# EAGLE design RFM2Pi_v2.5 (EAGLE 6.1)
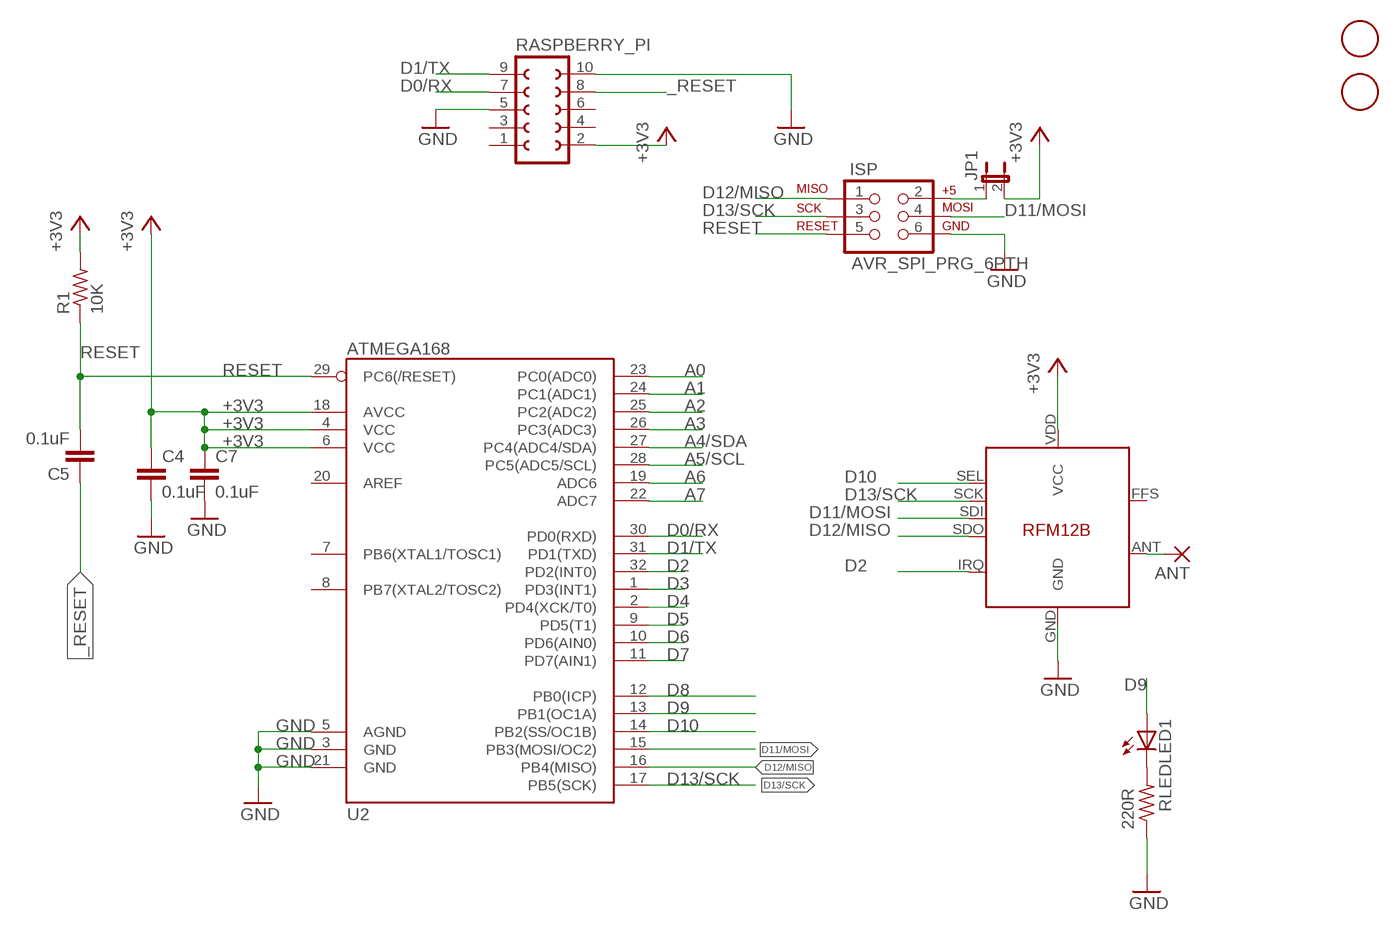
[diagram p0: schematic, sheet 1]

## Parts
ANT  1,6/0,8  [1,6/0,8]
C4  0.1uF  C-EUC0603  [C0603]
C5  0.1uF  C-EUC0603  [C0603]
C7  0.1uF  C-EUC0603  [C0603]
ISP  AVR_SPI_PRG_6PTH  [2X3]
JP1  JUMPER-2PTH  [1X02]
LED1  LEDSML0603  [SML0603]
R1  10K  R-US_R0603  [R0603]
RASPBERRY_PI  FE05-2  [FE05-2]
RFM12B  RFM12B  [RFM12B]
RLED  220R  R-US_R0603  [R0603]
U2  ATMEGA168  [TQFP32-08]
U$1  FIDUCIAL  [FIDUCIAL_1MM]
U$2  FIDUCIAL  [FIDUCIAL_1MM]

## Nets
+3V3 [power]: C4.1 C7.1 JP1.2 R1.2 RASPBERRY_PI.2 RFM12B.VDD(VCC) U2.4(VCC) U2.6(VCC) U2.18(AVCC)
+5V: ISP.2 JP1.1
_RESET: C5.1 RASPBERRY_PI.8
A0: U2.23(PC0(ADC0))
A1: U2.24(PC1(ADC1))
A2: U2.25(PC2(ADC2))
A3: U2.26(PC3(ADC3))
A4/SDA: U2.27(PC4(ADC4/SDA))
A5/SCL: U2.28(PC5(ADC5/SCL))
A6: U2.19(ADC6)
A7: U2.22(ADC7)
D0/RX: RASPBERRY_PI.7 U2.30(PD0(RXD))
D1/TX: RASPBERRY_PI.9 U2.31(PD1(TXD))
D2: RFM12B.IRQ U2.32(PD2(INT0))
D3: U2.1(PD3(INT1))
D4: U2.2(PD4(XCK/T0))
D5: U2.9(PD5(T1))
D6: U2.10(PD6(AIN0))
D7: U2.11(PD7(AIN1))
D8: U2.12(PB0(ICP))
D9: LED1.A U2.13(PB1(OC1A))
D10: RFM12B.SEL U2.14(PB2(SS/OC1B))
D11/MOSI: ISP.4 RFM12B.SDI U2.15(PB3(MOSI/OC2))
D12/MISO: ISP.1 RFM12B.SDO U2.16(PB4(MISO))
D13/SCK: ISP.3 RFM12B.SCK U2.17(PB5(SCK))
GND [power]: C4.2 C7.2 ISP.6 RASPBERRY_PI.5 RASPBERRY_PI.10 RFM12B.GND RLED.1 U2.3(GND) U2.5(AGND) U2.21(GND)
N$3: LED1.C RLED.2
N$6 [power]: ANT.1(P) RFM12B.ANT
RESET: C5.2 ISP.5 R1.1 U2.29(PC6(/RESET))
Unconnected: RASPBERRY_PI.1 RASPBERRY_PI.3 RASPBERRY_PI.4 RASPBERRY_PI.6 RFM12B.FFS U2.7(PB6(XTAL1/TOSC1)) U2.8(PB7(XTAL2/TOSC2)) U2.20(AREF)

## Library data of the parts
ANT = JeeLabs:1,6/0,8: THROUGH-HOLE PAD
C4 C5 = rcl:C-EU: CAPACITOR, European symbol
C7 = resistor:C-EU: CAPACITOR, European symbol
ISP = SparkFun:AVR_SPI_PRG_6: AVR ISP 6 Pin This is the reduced ISP connector for AVR programming. Common on Arduino. This footprint will take up less PCB space and can be used with a 10-pin to 6-pin adapter such as SKU: BOB-08508
JP1 = SparkFun:JUMPER-2: Jumper Basic 0.1" spaced jumper. Use with breakaway headers.
LED1 = led:LED: LED OSRAM: - CHIPLED LG R971, LG N971, LY N971, LG Q971, LY Q971, LO R971, LY R971 LH N974, LH R974 LS Q976, LO Q976, LY Q976 LO Q996 - Hyper CHIPLED LW Q18S LB Q993, LB Q99A, LB R99A - SideLED LS A670, LO A670, LY A670, LG A670, LP A670 LB A673, LV A673, LT A673, LW A673 LH A674 LY A675 LS A676, LA A676, LO A676, LY A676, LW A676 LS A679, LY A679, LG A679 - Hyper Micro SIDELED® LS Y876, LA Y876, LO Y876, LY Y876 LT Y87S - SmartLED LW L88C, LW L88S LB L89C, LB L89S, LG L890 LS L89K, LO L89K, LY L89K LS L896, LA L896, LO L896, LY L896 - TOPLED LS T670, LO T670, LY T670, LG T670, LP T670 LSG T670, LSP T670, LSY T670, LOP T670, LYG T670 LG T671, LOG T671, LSG T671 LB T673, LV T673, LT T673, LW T673 LH T674 LS T676, LA T676, LO T676, LY T676, LB T676, LH T676, LSB T676, LW T676 LB T67C, LV T67C, LT T67C, LS T67K, LO T67K, LY T67K, LW E67C LS E67B, LA E67B, LO E67B, LY E67B, LB E67C, LV E67C, LT E67C LW T67C LS T679, LY T679, LG T679 LS T770, LO T770, LY T770, LG T770, LP T770 LB T773, LV T773, LT T773, LW T773 LH T774 LS E675, LA E675, LY E675, LS T675 LS T776, LA T776, LO T776, LY T776, LB T776 LHGB T686 LT T68C, LB T68C - Hyper Mini TOPLED® LB M676 - Mini TOPLED Santana® LG M470 LS M47K, LO M47K, LY M47K Source: http://www.osram.convergy.de LUXEON: - LUMILED® LXK2-PW12-R00, LXK2-PW12-S00, LXK2-PW14-U00, LXK2-PW14-V00 LXK2-PM12-R00, LXK2-PM12-S00, LXK2-PM14-U00 LXK2-PE12-Q00, LXK2-PE12-R00, LXK2-PE12-S00, LXK2-PE14-T00, LXK2-PE14-U00 LXK2-PB12-K00, LXK2-PB12-L00, LXK2-PB12-M00, LXK2-PB14-N00, LXK2-PB14-P00, LXK2-PB14-Q00 LXK2-PR12-L00, LXK2-PR12-M00, LXK2-PR14-Q00, LXK2-PR14-R00 LXK2-PD12-Q00, LXK2-PD12-R00, LXK2-PD12-S00 LXK2-PH12-R00, LXK2-PH12-S00 LXK2-PL12-P00, LXK2-PL12-Q00, LXK2-PL12-R00 Source: www.luxeon.com KINGBRIGHT: KA-3528ASYC Source: www.kingbright.com
R1 RLED = adafruit:R-US_: RESISTOR, American symbol
RASPBERRY_PI = con-lsta:FE05-2: FEMALE HEADER; OC_FARNELL: unknown; OC_NEWARK: unknown
RFM12B = JeeLabs:RFM12B
U2 = SparkFun:ATMEGA168
U$1 U$2 = adafruit:FIDUCIAL: For use by pick and place machines to calibrate the vision/machine, 1mm By microbuilder.eu

## Net classes
0 default: width 0.254 mm, drill 0.254 mm, clearance 0.254 mm
1 power: width 0.305 mm, drill 0.305 mm, clearance 0.305 mm

## Board
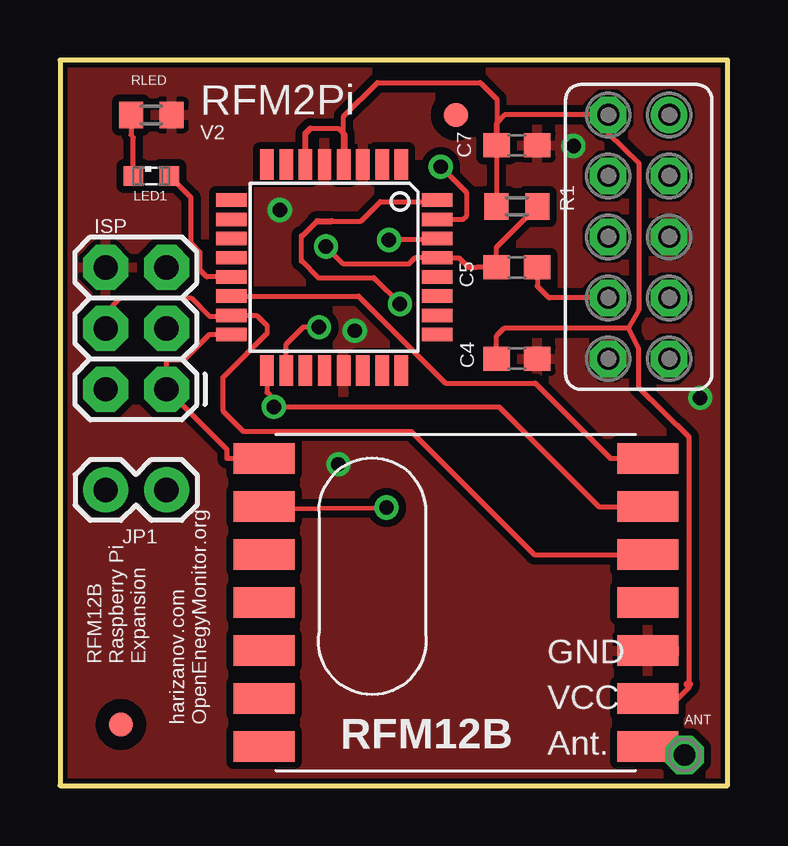
[diagram p1: board, top side]
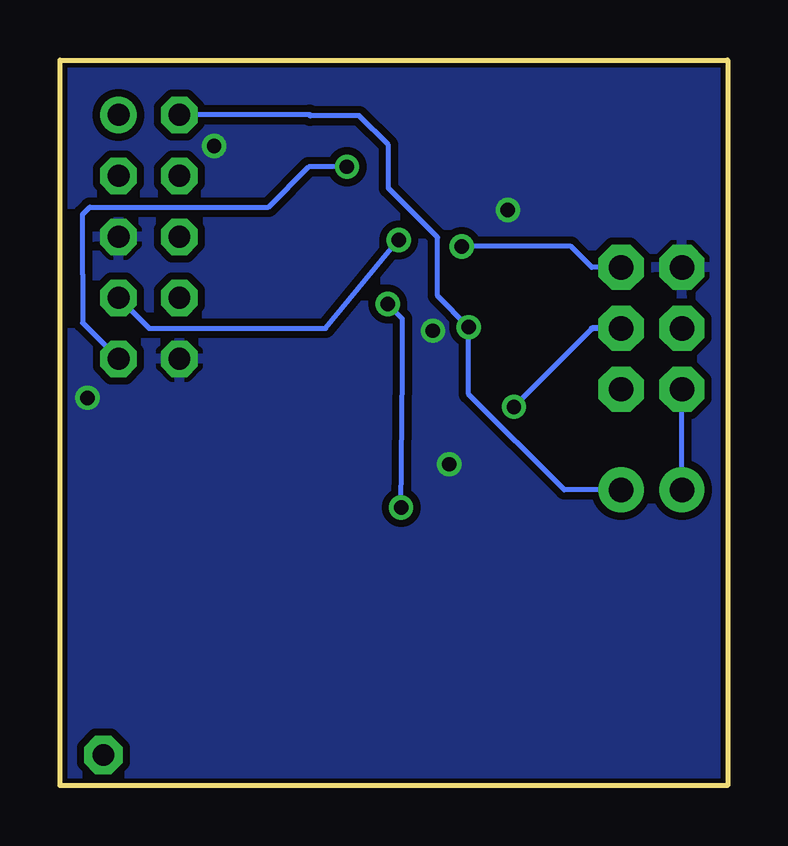
[diagram p2: board, bottom side, seen from below]

Size 27.84 x 30.23 mm. Coordinates in mm from the lower left corner, seen from the top.
Outline: 0,30.23 0,0 27.84,0 27.84,30.23 0,30.23
Copper layers (1*16): Top 0.035mm / dielectric 1.5mm / Bottom 0.035mm
Design rules "default": minimum track width 8mil, minimum drill 0.6mm, track to track 8mil, track to pad 8mil, pad to pad 8mil, via to via 8mil, smd to smd 8mil, copper to edge 8mil, drill to drill 8mil, minimum pad ring 12mil, minimum via ring 8mil, stop-mask expansion 4mil, vias tented up to drill 0mil, thermal gap 8mil

### Footprints (pad centres in the part's own frame; a part is rotated, then mirrored left to right if it is on the bottom)
1,6/0,8 = drill 0.9 pad 1.6 octagon: 1 0,0
C0603 = smd 1.1 x 1: 1 -0.85,0; 2 0.85,0
2X3 = drill 1.016 pad 1.88 octagon: 1 0,0; 2 0,2.54; 3 2.54,0; 4 2.54,2.54; 5 5.08,0; 6 5.08,2.54
1X02 = drill 1.016 pad 1.88: 1 0,0; 2 2.54,0
SML0603 = smd 0.8 x 0.8: A 0.75,0; C -0.75,0
R0603 = smd 1 x 1.1: 1 -0.85,0; 2 0.85,0
FE05-2 = drill 0.914: 1 -5.08,1.27 | drill 0.914 octagon: 2 -5.08,-1.27; 3 -2.54,1.27; 4 -2.54,-1.27; 5 0,1.27; 6 0,-1.27; 7 2.54,1.27; 8 2.54,-1.27; 9 5.08,1.27; 10 5.08,-1.27
RFM12B = smd 2.54 x 1.27: ANT 8,-6; FFS -8,2; GND 8,-2; IRQ -8,4; P$8 -8,0; P$9 -8,-2; P$10 -8,-4; P$12 -8,-6; P$16 8,0; SCK 8,4; SDI 8,2; SDO -8,6; SEL 8,6; VDD 8,-4
TQFP32-08 = smd 1.27 x 0.559: 1 -4.293,2.8; 2 -4.293,2; 3 -4.293,1.2; 4 -4.293,0.4; 5 -4.293,-0.4; 6 -4.293,-1.2; 7 -4.293,-2; 8 -4.293,-2.8; 17 4.293,-2.8; 18 4.293,-2; 19 4.293,-1.2; 20 4.293,-0.4; 21 4.293,0.4; 22 4.293,1.2; 23 4.293,2; 24 4.293,2.8 | smd 0.559 x 1.27: 9 -2.8,-4.293; 10 -2,-4.293; 11 -1.2,-4.293; 12 -0.4,-4.293; 13 0.4,-4.293; 14 1.2,-4.293; 15 2,-4.293; 16 2.8,-4.293; 25 2.8,4.293; 26 2,4.293; 27 1.2,4.293; 28 0.4,4.293; 29 -0.4,4.293; 30 -1.2,4.293; 31 -2,4.293; 32 -2.8,4.293
FIDUCIAL_1MM = smd 1 x 1: 1 0,0

### Placement (x,y rotation side)
ANT  26.04,1.27 0 top
C4  19.05,17.78 0 top
C5  19.05,21.59 180 top
C7  19.05,26.67 0 top
ISP  4.45,16.51 90 top
JP1  1.9,12.32 0 top
LED1  3.81,25.4 0 top
R1  19.05,24.13 180 top
RASPBERRY_PI  24.13,22.86 270 top
RFM12B  16.51,7.62 0 top
RLED  3.81,27.94 180 top
U2  11.43,21.59 270 top
U$1  16.51,27.94 0 top
U$2  2.54,2.54 0 top

### Tracks (layer width: path | path; a pad name or v marks a point on that pad's centre or on a via)
+3V3  (via drill 0.6 pad 1.01)
  Top 0.203: 23.71,19.05 18.51,19.05 18.2,18.74 C4.1 | 23.71,19.05 24.13,19.8 24.13,25.96 22.86,27.18 RASPBERRY_PI.2 18.54,27.94 18.2,27.6 C7.1 R1.2 | 26.24,4.14 26.24,4.22 26.24,14.51 24.13,16.57 24.13,18.19 23.71,19.05 | U2.18 9.43,18.39 10.14,19.1 v10.8,19.1 | 10.44,27.38 11.61,27.38 11.86,27.13 | U2.4 11.83,27.88 13.23,29.29 17.53,29.29 18.21,28.6 18.21,26.68 | 25.65,3.56 25.71,3.56 25.77,3.62 | RFM12B.VDD 25.77,3.62 | 25.77,3.62 26.16,4.01 | 26.16,4.01 26.24,4.09 | 26.16,4.22 26.16,4.01
  Top 0.254: U2.6 10.23,27.17 10.44,27.38 | 11.86,27.13 11.86,25.91 U2.4 | 18.21,26.68 C7.1
  Top 0.305: 26.16,4.22 26.24,4.22
  Bottom 0.203: 17.43,27.94 RASPBERRY_PI.2 | JP1.2 6.81,12.32 10.8,16.3 v10.8,19.1 12.1,20.4 12.1,22.84 14.15,24.89 14.15,26.7 15.37,27.91 17.41,27.91
  Bottom 0.254: 17.41,27.91 17.43,27.94
+5V
  Bottom 0.203: JP1.1 ISP.2
_RESET
  Top 0.203: C5.1 19.9,20.81 20.39,20.32 RASPBERRY_PI.8
D0/RX  (via drill 0.6)
  Top 0.203: U2.30 15.67,22.73 v13.72,22.73
  Bottom 0.203: RASPBERRY_PI.7 24.13,19.05 16.76,19.05 v13.72,22.73
D1/TX  (via drill 0.6)
  Top 0.203: U2.31 16.81,23.59 16.97,23.75 16.97,24.69 v15.88,25.78
  Bottom 0.203: v15.88,25.78 17.48,25.78 19.15,24.11 26.59,24.11 26.9,23.8 26.9,21.31 26.9,19.28 RASPBERRY_PI.9
D2  (via drill 0.6)
  Top 0.203: 15.6,24.33 13.36,24.33 12.55,23.52 11.33,23.52 | 10.72,23.52 10.11,22.91 10.06,22.91 10.06,21.84 10.08,21.84 10.77,21.16 13.08,21.16 13.16,21.08 v14.17,20.07 | 7.87,11.53 v13.61,11.58
  Top 0.254: 10.72,23.52 11.33,23.52 | 7.87,11.53 8.48,11.53 RFM12B.IRQ | 15.6,24.33 U2.32
  Bottom 0.203: v14.17,20.07 13.56,19.46 13.56,17.22 v13.61,11.58
D9
  Top 0.203: U2.13 6.12,21.19 5.84,21.46 5.84,22.23 5.46,22.61 5.46,24.5 LED1.A
D10
  Top 0.203: RFM12B.SEL 22.96,13.62 19.82,16.76 16.07,16.76 12.45,20.39 U2.14
D11/MOSI
  Top 0.203: U2.15 8.2,19.59 8.64,19.15 8.64,18.85 6.78,16.99 6.78,15.62 7.64,14.76 14.64,14.76 19.78,9.62 RFM12B.SDI | ISP.4 1.9,19.68 2.54,20.32 5.46,20.32 6.22,19.56 7.11,19.56
  Top 0.254: 7.11,19.56 U2.15
D12/MISO
  Top 0.203: RFM12B.SDO 6.96,13.62 6.96,13.99 ISP.1 4.45,17.73 5.16,17.73 6.22,18.79 U2.16
D13/SCK  (via drill 0.6 pad 1.01)
  Top 0.203: v8.91,15.78 18.31,15.78 22.47,11.62 RFM12B.SCK | 8.91,16.1 8.63,16.38 U2.17
  Top 0.254: 8.91,16.1 v8.91,15.78
  Bottom 0.203: v8.91,15.78 5.66,19.03
  Bottom 0.254: ISP.3 5.66,19.05 5.66,19.03
GND  (via drill 0.6 pad 1.01)
  other vias: 9.17,23.98 12.29,18.95 21.41,26.64 11.61,13.39 26.7,16.15
  pour Top (isolate 0): -1.14,31.75 -1.4,31.75 -1.4,-1.52 29.34,-1.52 29.34,31.62 -1.27,31.62
  pour Bottom (isolate 0): -0.51,31.5 28.83,31.5 28.83,-0.64 -0.51,-0.64
N$3
  Top 0.203: RLED.2 2.96,27.11 3.06,27.01 LED1.C
N$6
  Top 0.305: ANT.1 24.78,1.27 24.78,1.35 RFM12B.ANT
RESET  (via drill 0.6 pad 1.01)
  Top 0.203: v11.09,22.46 11.83,21.72 14.54,21.72 14.81,21.99 U2.29 16.64,21.99 17.04,21.59 17.37,21.59 C5.2 18.2,22.43 R1.1
  Bottom 0.203: v11.09,22.46 6.53,22.46 5.66,21.59 ISP.5

### Text on the board
_tsilk: RFM2Pi | V2 | RFM12B / Raspberry Pi / Expansion | harizanov.com / OpenEnegyMonitor.org